# EAGLE schematic Pressure_sensor_prototype_2 (EAGLE 7.2.0)
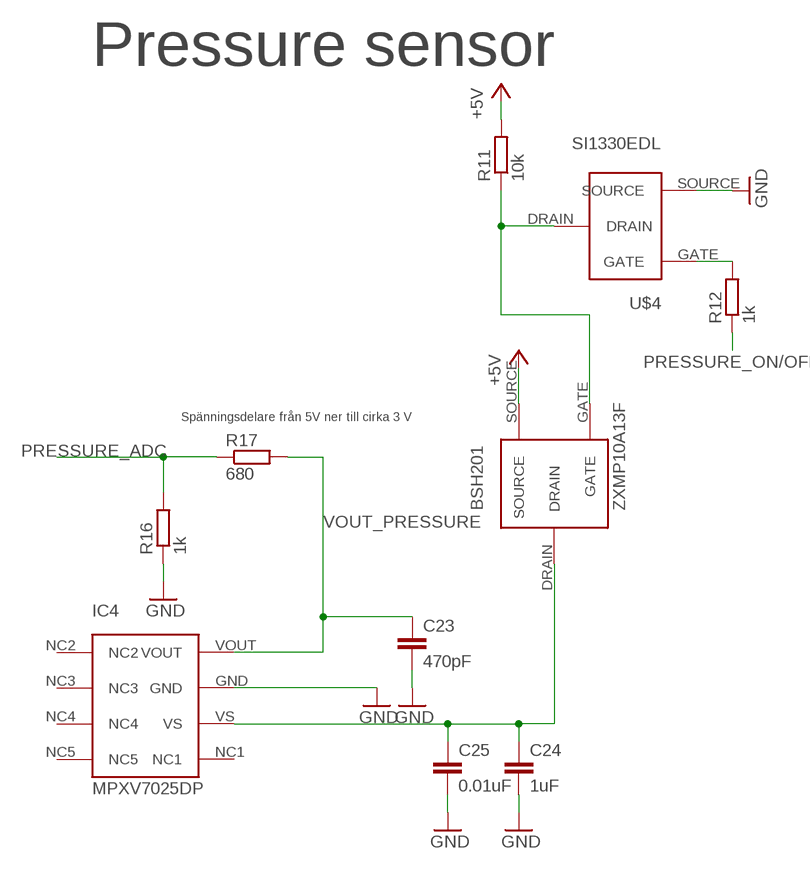
[diagram p0: schematic, sheet 1]

## Parts
BSH201  ZXMP10A13F  [P-CHANNEL]
C23  470pF  C-EUC0805  [C0805]
C24  1uF  C-EUC0805  [C0805]
C25  0.01uF  C-EUC0805  [C0805]
IC4  MPXV7025DP  [CASE1351-01]
R11  10k  R-EU_R0805  [R0805]
R12  1k  R-EU_R0805  [R0805]
R16  1k  R-EU_R0805  [R0805]
R17  680  R-EU_R0805  [R0805]
U$4  SI1330EDL  [SOT-323]

## Nets
+5V: BSH201.SOURCE R11.2
GND: C23.2 C24.2 C25.2 IC4.GND R16.1 U$4.SOURCE
N$14: BSH201.GATE R11.1 U$4.DRAIN
N$15: R12.2 U$4.GATE
PRESSURE_ADC: R16.2 R17.1
PRESSURE_ON/OFF: R12.1
V_PRESSURE: BSH201.DRAIN C24.1 C25.1 IC4.VS
VOUT_PRESSURE: C23.1 IC4.VOUT R17.2
Unconnected: IC4.NC1 IC4.NC2 IC4.NC3 IC4.NC4 IC4.NC5

## Notes on the sheet
- Pressure sensor
- Spänningsdelare från 5V ner till cirka 3 V

## Library data of the parts
BSH201 = ZXMP10A13F:ZXMP10A13F
C23-C25 = rcl:C-EU: CAPACITOR, European symbol
IC4 = MPXV7025:MPXV7025DP
R11 R12 R16 R17 = rcl:R-EU_: RESISTOR, European symbol
U$4 = SI1330EDL:SI1330EDL